# EAGLE design AmbaSat-02-STS21 (EAGLE 9.3.2)
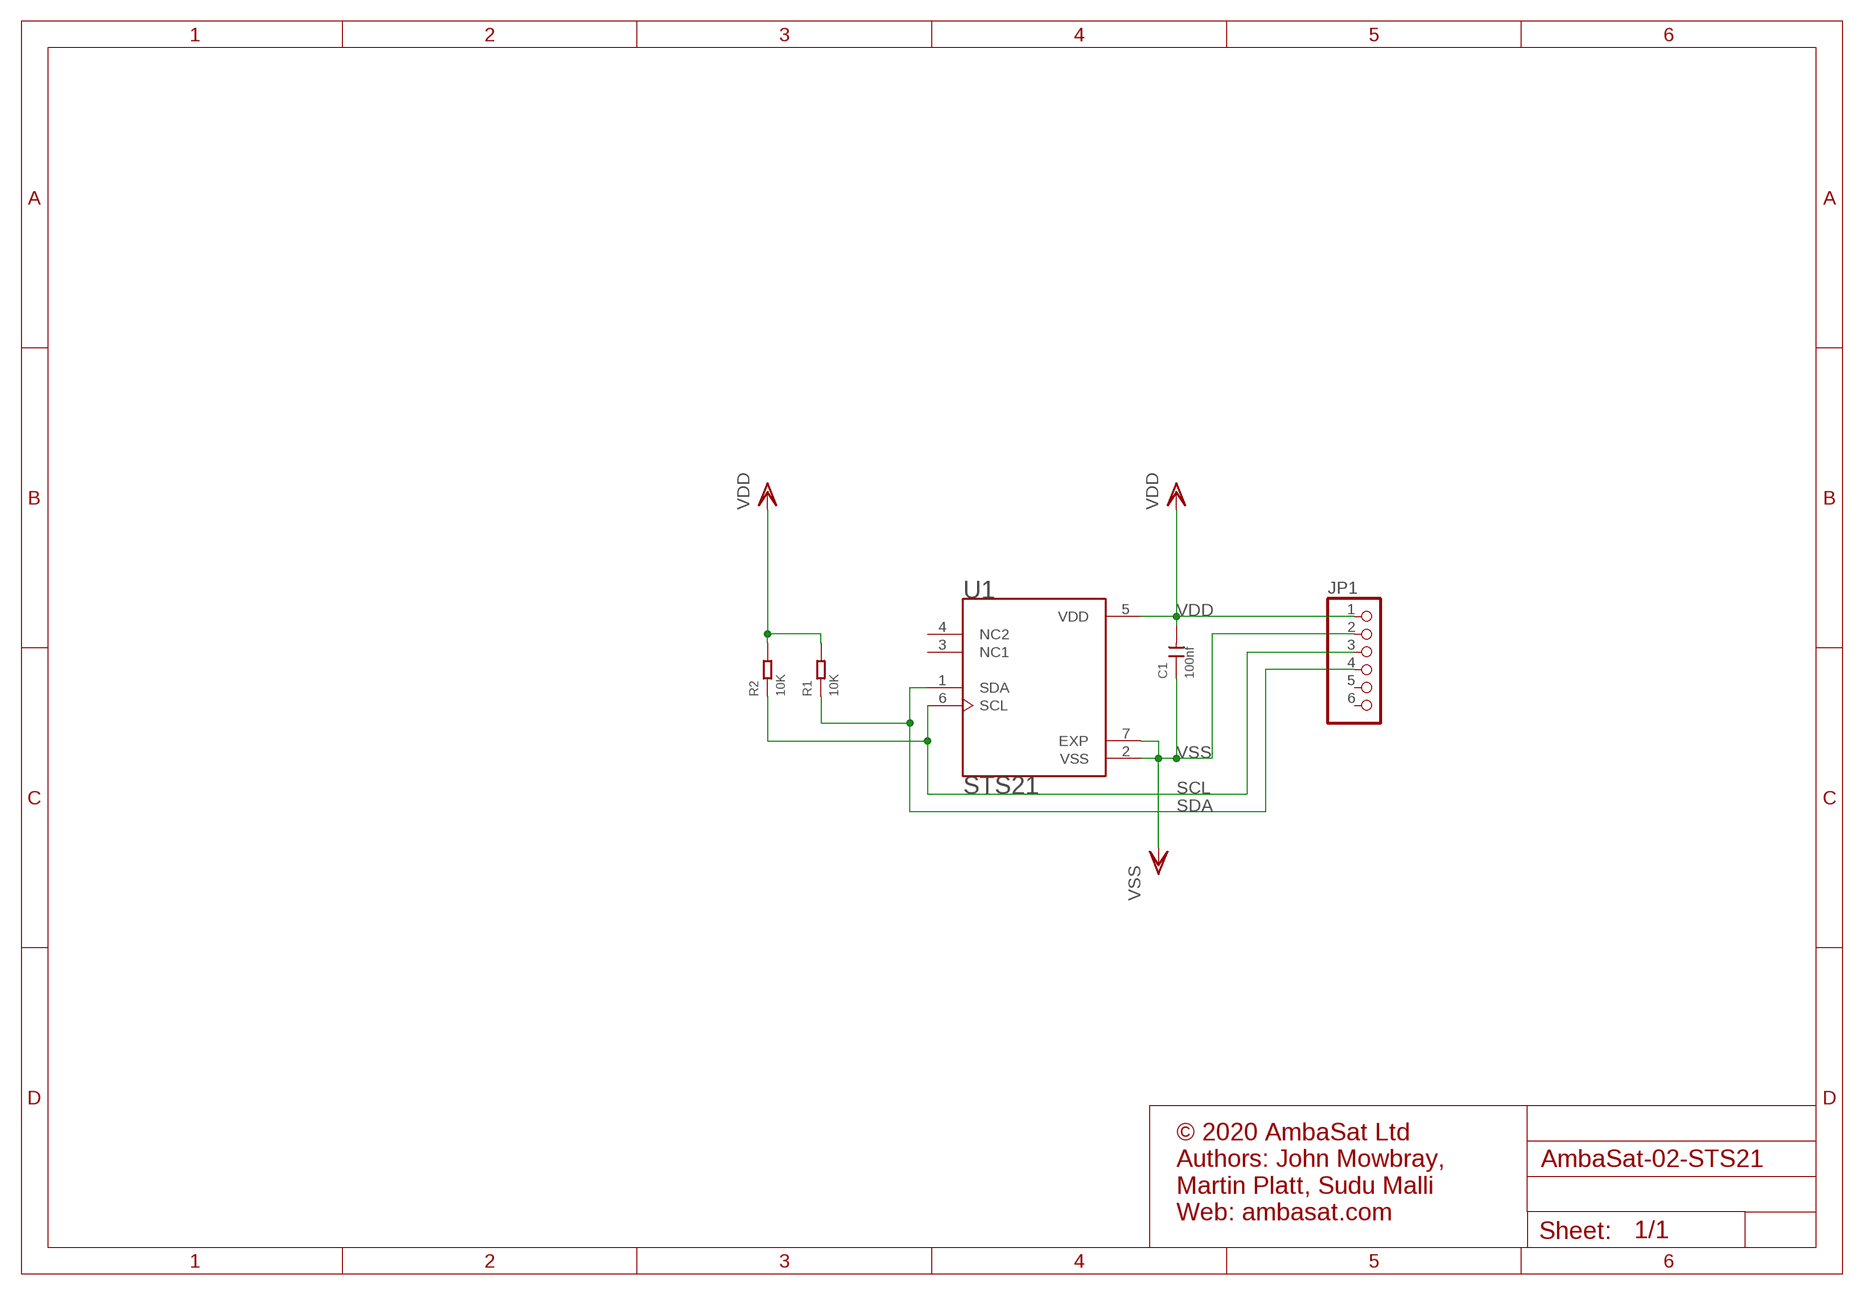
[diagram p0: schematic, sheet 1]

## Parts
C1  100nf  CERAMIC-100NF-50V-10%-X7R(0805)  [C0805]
JP1  HEADER-1X6  [1X06_OVAL]
R1  10K  SMD-RES-10K-1%-1/8W(0805)  [R0805]
R2  10K  SMD-RES-10K-1%-1/8W(0805)  [R0805]
U1  STS21  [XDCR_SGP30-2.5K]

## Nets
SCL: JP1.3 R2.1 U1.6(SCL)
SDA: JP1.4 R1.1 U1.1(SDA)
VDD: C1.2 JP1.1 R1.2 R2.2 U1.5(VDD)
VSS: C1.1 JP1.2 U1.2(VSS) U1.7(EXP)
Unconnected: JP1.5 JP1.6 U1.3(NC1) U1.4(NC2)

## Notes on the sheet
- © 2020 AmbaSat Ltd
  Authors: John Mowbray, 
  Martin Platt, Sudu Malli
  Web: ambasat.com

## Library data of the parts
C1 = Seeed-Capacitor:CERAMIC-100NF-50V-10%-X7R(0805): 302010165; MPN: CC0805KRX7R9BB104
JP1 = microbuilder:HEADER-1X6: PIN HEADER
R1 R2 = Seeed-Resistor:SMD-RES-10K-1%-1/8W(0805): 301010361; MPN: RC0805FR-0710KL
U1 = STS21:STS21: Temperature Sensor Digital, Local -40°C ~ 125°C 14 b 6-DFN (3x3)SENSOR DIGITAL -40C-125C 6DFN; DIGIKEY-PN: 1649-1016-1-ND

## Board
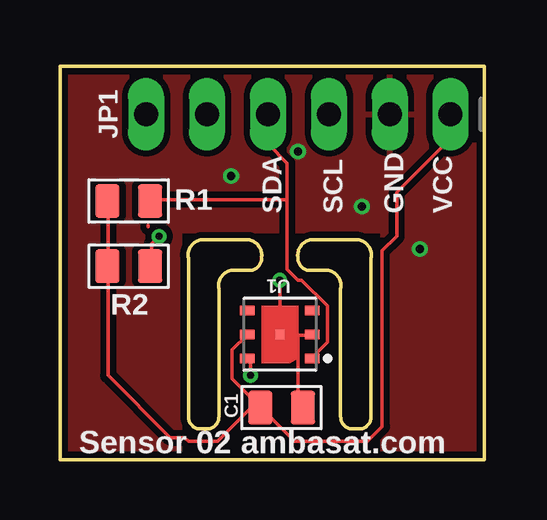
[diagram p1: board, top side]
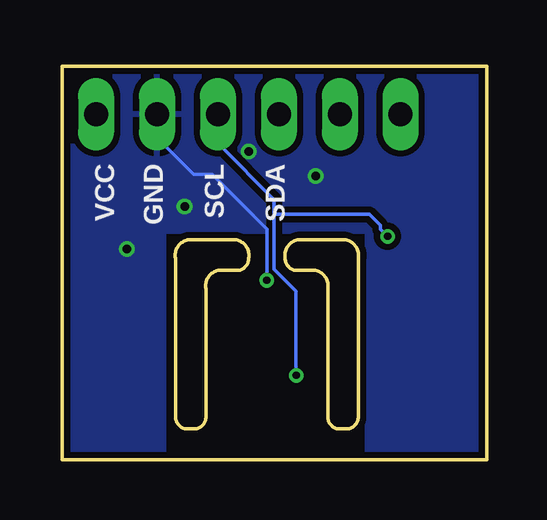
[diagram p2: board, bottom side, seen from below]

Size 17.7 x 16.4 mm. Coordinates in mm from the lower left corner, seen from the top.
Outline: 0,16.4 17.7,16.4 17.7,0 0,0 0,16.4
Outline: 6.63,1.8 arc-90 6.12,1.29 5.86,1.29 arc-90 5.36,1.8 5.36,8.4 arc-90 5.86,9.16 7.9,9.16 arc-90 8.4,8.4 arc-90 7.9,7.89 7.13,7.89 arc90 6.63,7.13 6.63,1.8
Outline: 11.71,1.8 arc90 12.21,1.29 12.47,1.29 arc90 12.98,1.8 12.98,8.4 arc90 12.47,9.16 10.44,9.16 arc90 9.93,8.4 arc90 10.44,7.89 11.2,7.89 arc-90 11.71,7.13 11.71,1.8
Copper layers (1*16): Top 0.035mm / dielectric 1.5mm / Bottom 0.035mm
Design rules "SeeedStudio_2layer_DRU_no_angle_20140221": minimum track width 6mil, minimum drill 12mil, track to track 6mil, track to pad 6mil, pad to pad 6mil, via to via 6mil, smd to smd 0mil, copper to edge 10mil, drill to drill 10mil, minimum pad ring 10mil, minimum via ring 6mil, stop-mask expansion 2mil, vias tented up to drill 100mil, thermal gap 10mil

### Footprints (pad centres in the part's own frame; a part is rotated, then mirrored left to right if it is on the bottom)
C0805 = smd 1.397 x 1.016: 1 0,0.889; 2 0,-0.889
1X06_OVAL = drill 1 long: 1 -6.35,0; 2 -3.81,0; 3 -1.27,0; 4 1.27,0; 5 3.81,0; 6 6.35,0
R0805 = smd 1.397 x 1.016: 1 0,0.889; 2 0,-0.889
XDCR_SGP30-2.5K = smd 0.6 x 0.4: 1 -1.35,1; 2 -1.35,0; 3 -1.35,-1; 4 1.35,-1; 5 1.35,0; 6 1.35,1 | smd 0.35 x 0.4: 7 0,0

### Placement (x,y rotation side)
C1  9.24,2.18 270 top
JP1  9.94,14.4 180 top
R1  2.87,10.79 270 top
R2  2.87,8.07 270 top
U1  9.17,5.23 180 top

### Tracks (layer width: path | path; a pad name or v marks a point on that pad's centre or on a via)
SCL  (via drill 0.3)
  Top 0.152: v7.95,3.52 7.95,4.13 U1.6 | v4.14,9.31 3.83,9.01 3.83,8.1 R2.1
  Bottom 0.152: v7.95,3.52 7.95,7.03 8.86,7.94 8.86,10.23 | 8.86,10.23 8.86,10.84 11.15,13.12 11.15,14.34 JP1.3 | v4.14,9.31 4.44,9.62 4.44,9.77 4.9,10.23 8.86,10.23
SDA
  Top 0.152: 9.47,10.84 9.47,12.36 8.71,13.12 8.71,14.34 JP1.4 | 9.47,10.84 9.47,7.94 9.93,7.49 10.08,7.49 11.15,6.42 11.15,4.9 10.54,4.29 U1.1 | 9.47,10.84 3.83,10.84 R1.1
VDD
  Top 0.152: U1.5 7.79,5.2 7.19,4.59 7.19,3.37 8.25,2.3 C1.2 | R1.2 2,10.69 2,8.1 R2.2 2,7.94 2,3.52 4.59,0.93 5.2,0.93 5.36,0.78 6.58,0.78 7.95,2.15 8.25,2.15 C1.2 | JP1.1 16.18,14.34 16.18,13.28 14.04,11.14 14.04,9.31 13.43,8.71 13.43,1.39 12.82,0.78 9.78,0.78 8.4,2.15 C1.2
VSS  (via drill 0.3, 0.35)
  Top 0.152: 9.93,5.2 9.17,5.2 U1.7 v9.17,7.49 | 9.93,5.2 10.39,5.2 U1.2 | 9.93,5.2 9.93,2.46 10.08,2.3 C1.1
  Bottom 0.152: v9.17,7.49 9.17,9.62 11.45,11.91 12.21,11.91 13.74,13.43 13.74,14.34 JP1.2
  other vias: 15.01,8.78 12.6,10.56 7.13,11.83 9.93,12.85
  pour Bottom (isolate 0.254): 0.02,16.4 17.68,16.4 17.68,0.02 13.48,0.02 13.48,9.54 4.98,9.54 4.98,0.02 0.02,0.02
  pour Top (isolate 0.254): 0.02,16.4 17.68,16.4 17.68,0.02 13.48,0.02 13.48,9.54 4.98,9.54 4.98,0.02 0.02,0.02
VSS_X1
  Top 0.152: 3.68,9.77 3.68,9.71

### Text on the board
tPlace: SDA | SCL | GND | VCC | Sensor 02 ambasat.com
bPlace: SDA | SCL | GND | VCC